# EAGLE design Displayduino_3_0 (EAGLE 4.16)
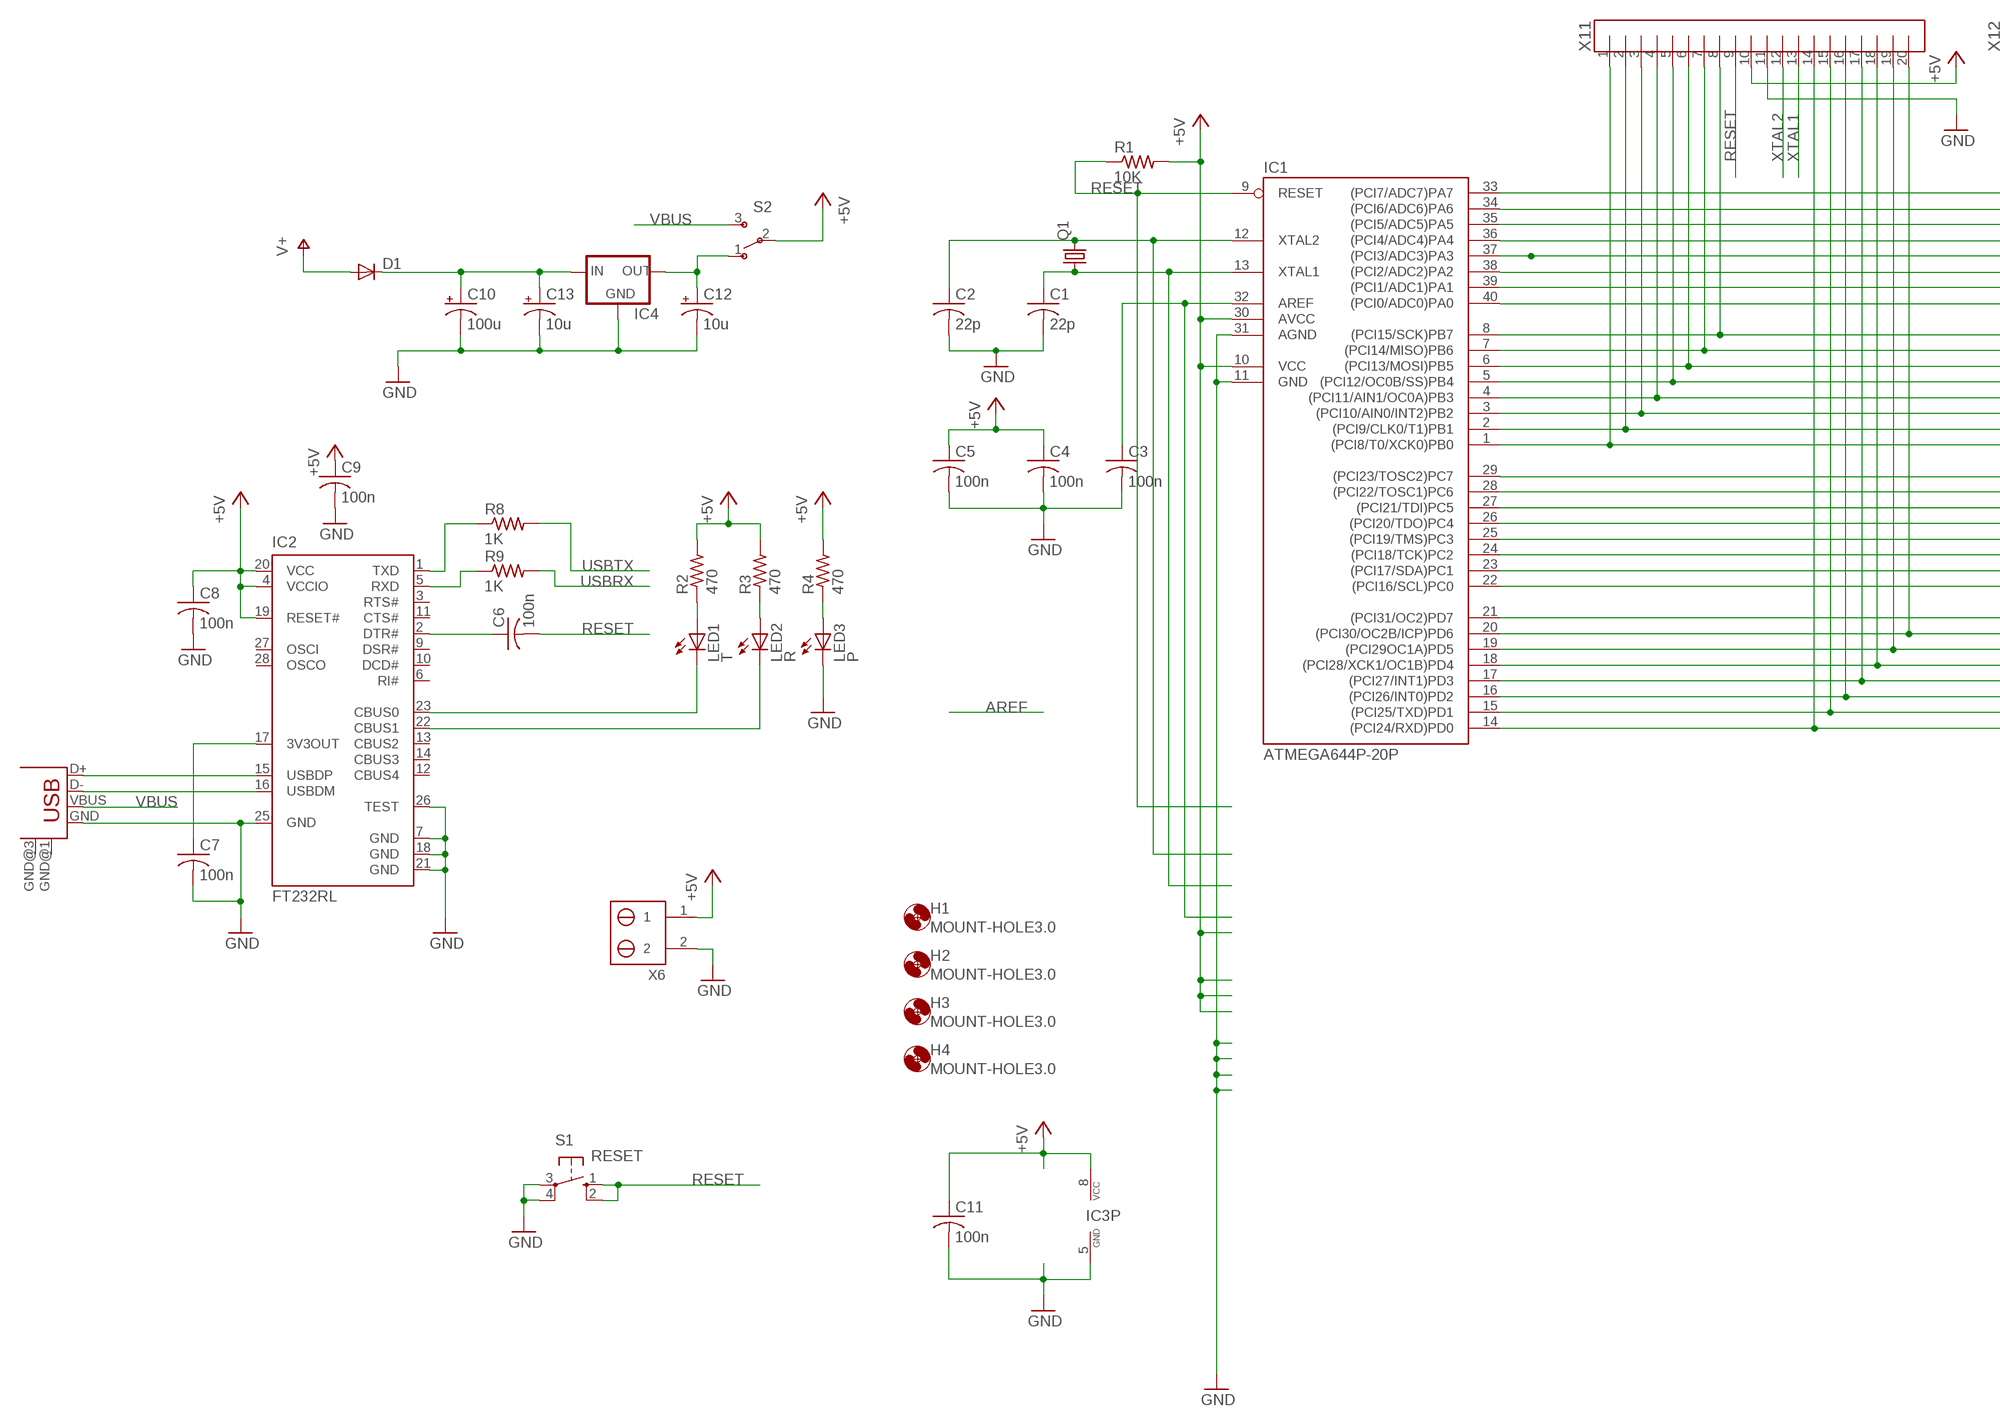
[diagram p0: schematic, sheet 1, part 1 of 2]
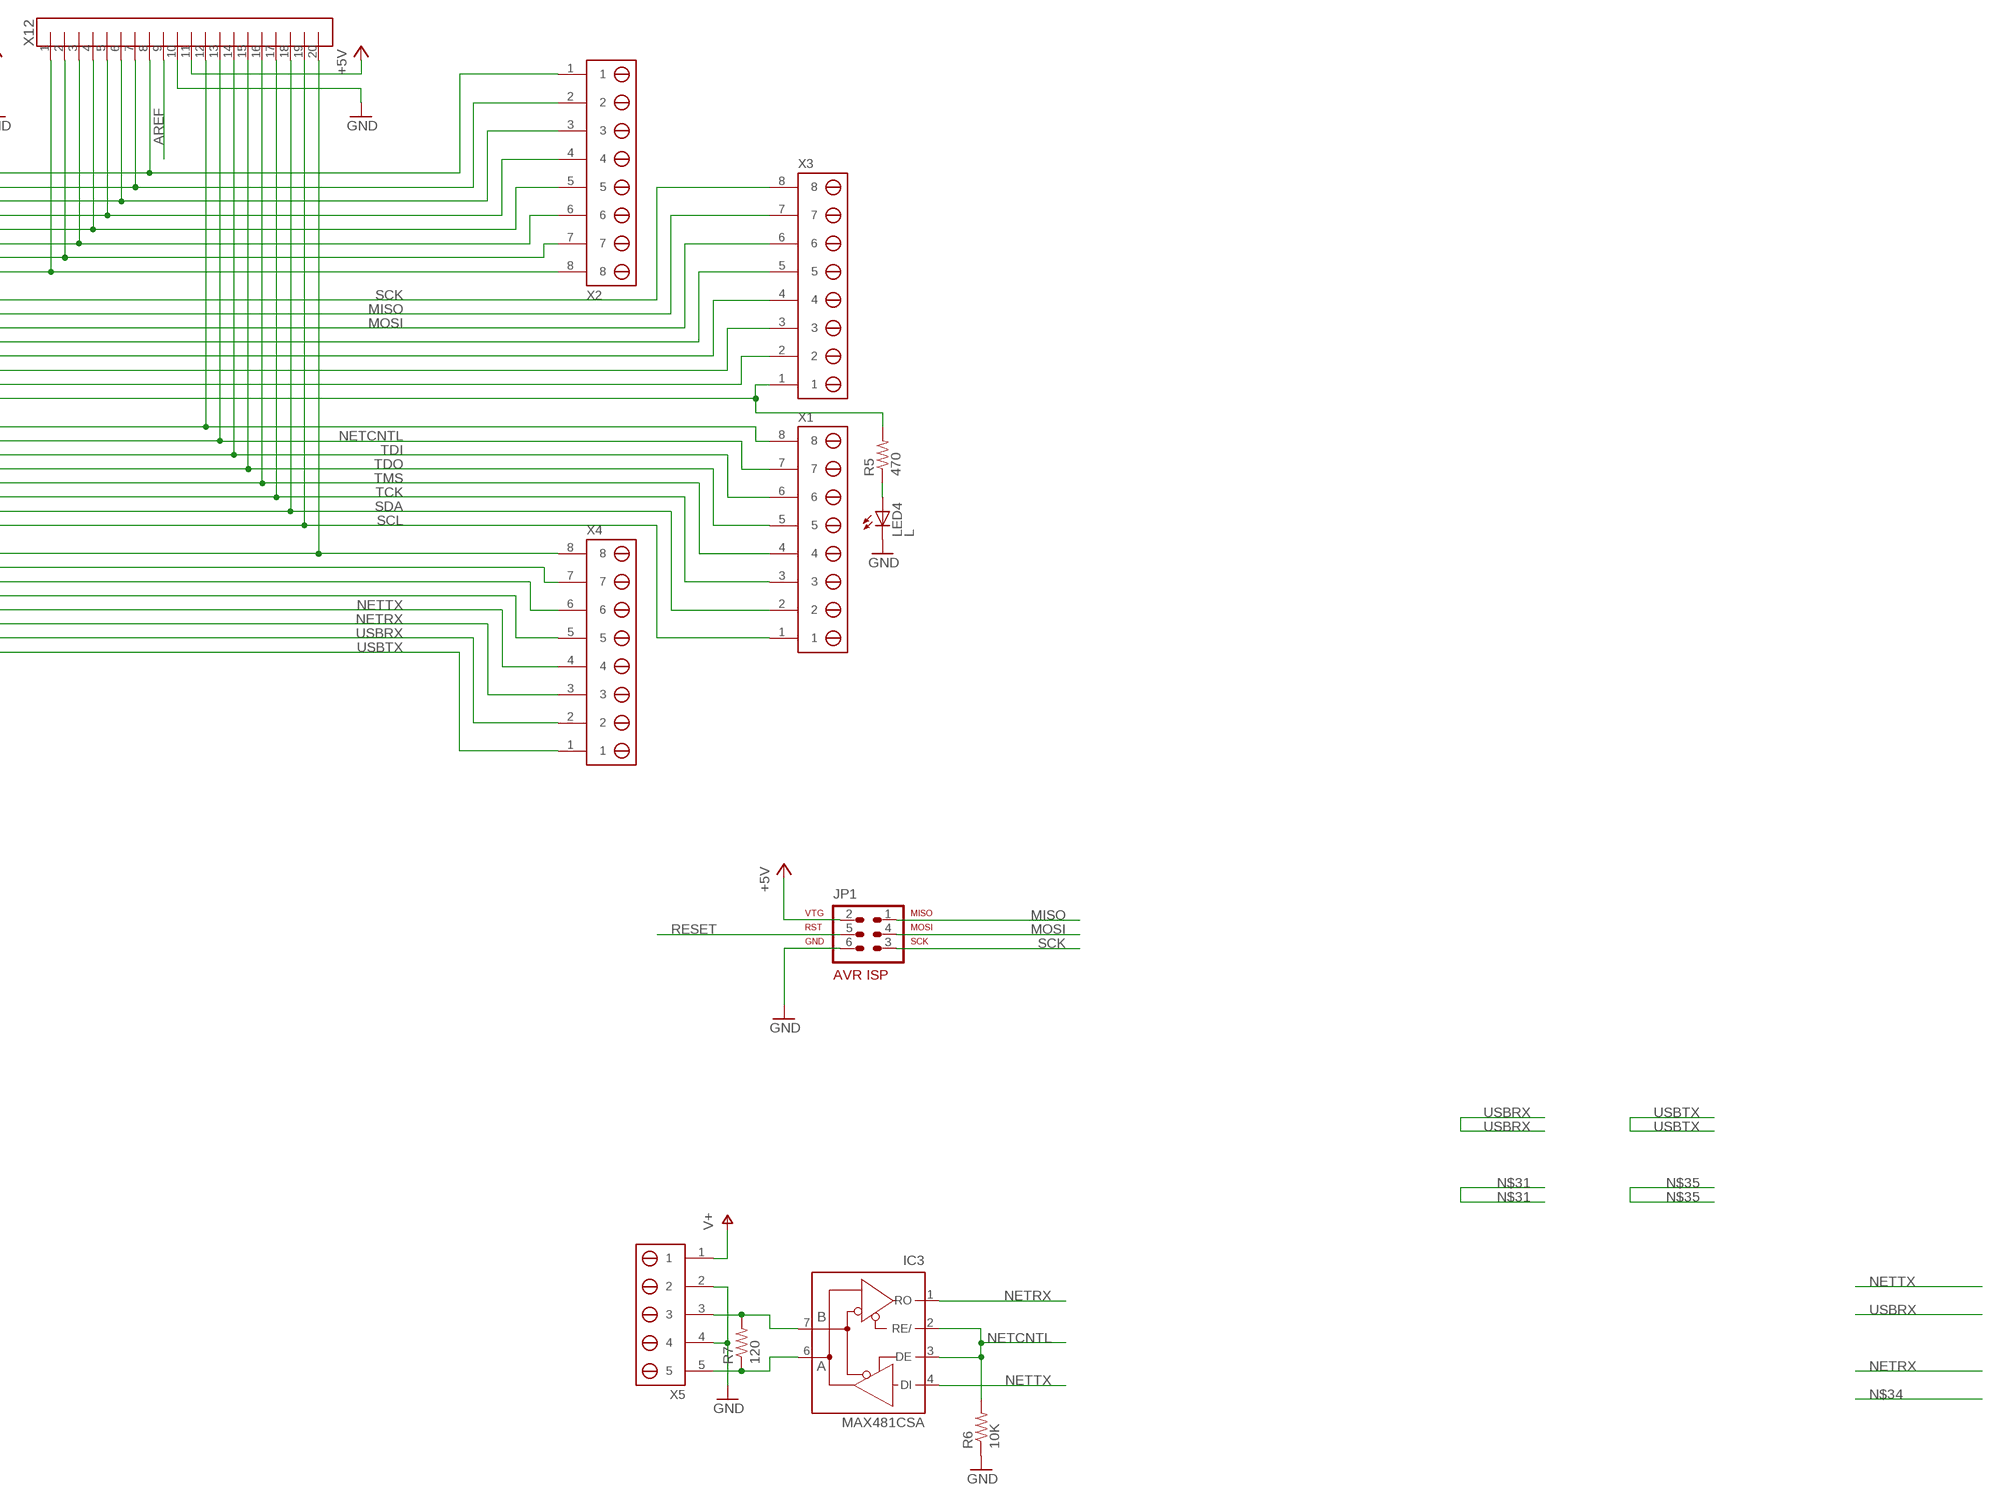
[diagram p1: schematic, sheet 1, part 2 of 2]

## Parts
C1  22p  C-USC0603  [C0603]
C2  22p  C-USC0603  [C0603]
C3  100n  C-USC0603  [C0603]
C4  100n  C-USC0603  [C0603]
C5  100n  C-USC0603  [C0603]
C6  100n  C-USC0603  [C0603]
C7  100n  C-USC0603  [C0603]
C8  100n  C-USC0603  [C0603]
C9  100n  C-USC0603  [C0603]
C10  100u  CPOL-USD  [PANASONIC_D]
C11  100n  C-USC0603  [C0603]
C12  10u  CPOL-USB  [PANASONIC_B]
C13  10u  CPOL-USB  [PANASONIC_B]
D1  DIODESMA  [SMA-DIODE]
H1  MOUNT-HOLE3.0  [3,0]
H2  MOUNT-HOLE3.0  [3,0]
H3  MOUNT-HOLE3.0  [3,0]
H4  MOUNT-HOLE3.0  [3,0]
IC1  ATMEGA644P-20P  ATMEGA644-20P  [DIL40]
IC2  FT232RL  [SSOP28]
IC3  MAX481CSA  [SO08]
IC4  LM1117  [SOT223]
JP1  AVR-ISP-6  [AVR-ISP-6]
LED1  T  LEDCHIP-LED0603  [CHIP-LED0603]
LED2  R  LEDCHIP-LED0603  [CHIP-LED0603]
LED3  P  LEDCHIP-LED0603  [CHIP-LED0603]
LED4  L  LEDCHIP-LED0603  [CHIP-LED0603]
Q1  CRYSTALCTS406  [CTS406]
R1  10K  R-US_R0603  [R0603]
R2  470  R-US_R0603  [R0603]
R3  470  R-US_R0603  [R0603]
R4  470  R-US_R0603  [R0603]
R5  470  R-US_R0603  [R0603]
R6  10K  R-US_R0603  [R0603]
R7  120  R-US_R0603  [R0603]
R8  1K  R-US_R0603  [R0603]
R9  1K  R-US_R0603  [R0603]
S1  RESET  10-XXSMT  [B3FS]
S2  SWITCH-SPSTSMD  [AYZ0202]
X1  140-A-126-SMD/8  [SMT-SCREW-500-8]
X2  140-A-126-SMD/8  [SMT-SCREW-500-8]
X3  140-A-126-SMD/8  [SMT-SCREW-500-8]
X4  140-A-126-SMD/8  [SMT-SCREW-500-8]
X5  140-A-126-SMD/5  [SMT-SCREW-500-5]
X6  140-A-126-SMD/2  [SMT-SCREW-500-2]
X7  USB-MB-S  [USB-MB-S]
X11  M20-100MIL  [100MIL-20]
X12  M20-100MIL  [100MIL-20]

## Nets
+5V: C4.1 C5.1 C8.1 C9.1 C11.1 IC1.10(VCC) IC1.30(AVCC) IC2.4(VCCIO) IC2.19(RESET#) IC2.20(VCC) IC3.8(VCC) JP1.2 R1.2 R2.2 R3.2 R4.2 S2.2(P) X6.1 X11.10 X12.11
AREF: C3.1 IC1.32(AREF) X12.9
GND: C1.2 C2.2 C3.2 C4.2 C5.2 C7.2 C8.2 C9.2 C10.- C11.2 C12.- C13.- IC1.11(GND) IC1.31(AGND) IC2.7(GND) IC2.18(GND) IC2.21(GND) IC2.25(GND) IC2.26(TEST) IC3.5(GND) IC4.1(GND) JP1.6 LED3.C LED4.C R6.1 S1.3(P) S1.4(P1) X5.2 X5.4 X6.2 X7.GND X11.11 X12.10
MISO: IC1.7((PCI14/MISO)PB6) JP1.1 X3.7 X11.7
MOSI: IC1.6((PCI13/MOSI)PB5) JP1.4 X3.6 X11.6
N$1: IC1.20((PCI30/OC2B/ICP)PD6) X4.7 X11.20
N$2: IC1.19((PCI29OC1A)PD5) X4.6 X11.19
N$3: IC1.18((PCI28/XCK1/OC1B)PD4) X4.5 X11.18
N$4: IC2.15(USBDP) X7.D+
N$5: IC2.16(USBDM) X7.D-
N$6: LED1.A R2.1
N$7: C7.1 IC2.17(3V3OUT)
N$8: IC1.21((PCI31/OC2)PD7) X4.8 X12.20
N$9: LED2.A R3.1
N$10: IC2.5(RXD) R9.1
N$11: IC2.23(CBUS0) LED1.C
N$12: IC2.22(CBUS1) LED2.C
N$13: LED3.A R4.1
N$14: LED4.A R5.1
N$15: C12.+ IC4.2(OUT) S2.1(O)
N$16: IC1.33((PCI7/ADC7)PA7) X2.1 X12.8
N$17: IC1.34((PCI6/ADC6)PA6) X2.2 X12.7
N$18: IC1.35((PCI5/ADC5)PA5) X2.3 X12.6
N$19: IC1.36((PCI4/ADC4)PA4) X2.4 X12.5
N$20: IC1.37((PCI3/ADC3)PA3) X2.5 X12.4
N$21: IC1.38((PCI2/ADC2)PA2) X2.6 X12.3
N$22: IC1.39((PCI1/ADC1)PA1) X2.7 X12.2
N$23: IC1.40((PCI0/ADC0)PA0) X2.8 X12.1
N$24: IC1.1((PCI8/T0/XCK0)PB0) R5.2 X3.1 X11.1
N$25: IC1.2((PCI9/CLK0/T1)PB1) X3.2 X11.2
N$26: IC1.3((PCI10/AIN0/INT2)PB2) X3.3 X11.3
N$27: IC1.4((PCI11/AIN1/OC0A)PB3) X3.4 X11.4
N$28: IC1.5((PCI12/OC0B/SS)PB4) X3.5 X11.5
N$30: IC2.1(TXD) R8.1
N$32: IC1.29((PCI23/TOSC2)PC7) X1.8 X12.12
N$33: C6.1 IC2.2(DTR#)
N$104: C10.+ C13.+ D1.C IC4.3(IN)
NETCNTL: IC1.28((PCI22/TOSC1)PC6) IC3.2(RE/) IC3.3(DE) R6.2 X1.7 X12.13
NETRX: IC1.16((PCI26/INT0)PD2) IC3.1(RO) X4.3 X11.16
NETTX: IC1.17((PCI27/INT1)PD3) IC3.4(DI) X4.4 X11.17
RESET: C6.2 IC1.9(RESET) JP1.5 R1.1 S1.1(S) S1.2(S1) X11.9
RS485A: IC3.6(A) R7.1 X5.5
RS485B: IC3.7(B) R7.2 X5.3
SCK: IC1.8((PCI15/SCK)PB7) JP1.3 X3.8 X11.8
SCL: IC1.22((PCI16/SCL)PC0) X1.1 X12.19
SDA: IC1.23((PCI17/SDA)PC1) X1.2 X12.18
TCK: IC1.24((PCI18/TCK)PC2) X1.3 X12.17
TDI: IC1.27((PCI21/TDI)PC5) X1.6 X12.14
TDO: IC1.26((PCI20/TDO)PC4) X1.5 X12.15
TMS: IC1.25((PCI19/TMS)PC3) X1.4 X12.16
USBRX: IC1.15((PCI25/TXD)PD1) R9.2 X4.2 X11.15
USBTX: IC1.14((PCI24/RXD)PD0) R8.2 X4.1 X11.14
V+: D1.A X5.1
VBUS: S2.3(S) X7.VBUS
XTAL1: C1.1 IC1.13(XTAL1) Q1.1 X11.13
XTAL2: C2.1 IC1.12(XTAL2) Q1.3 X11.12
Unconnected: IC2.3(RTS#) IC2.6(RI#) IC2.9(DSR#) IC2.10(DCD#) IC2.11(CTS#) IC2.12(CBUS4) IC2.13(CBUS2) IC2.14(CBUS3) IC2.27(OSCI) IC2.28(OSCO) X7.GND@1(GND) X7.GND@3(GND)

## Library data of the parts
C1-C9 C11 = rcl:C-US: CAPACITOR, American symbol
C10 C12 C13 = rcl:CPOL-US: POLARIZED CAPACITOR, American symbol
D1 = sfe-sparkfun:DIODE: Diode These are standard reverse protection diodes and small signal diodes. SMA package can handle up to about 1A. SOD-323 can handle about 200mA. What the SOD-323 package when ordering, there are some mfgs out there that are 5-pin packages.
H1-H4 = holes:MOUNT-HOLE: MOUNTING HOLE with drill center marker
IC1 = avr:ATMEGA644*P: MICROCONTROLLER 64 kBytes FLASH 4 kBytes SRAM 2 kBytes EEPROM DUAL USART 8-channel 10 bit ADC
IC2 = ftdichip:FT232R: Source: http://www.ftdichip.com/Documents/DataSheets/DS_FT232R_v104.pdf
IC3 = maxim:MAX481CSA: RS485 TRANSEIVER
IC4 = v-reg-3:LM1117
JP1 = atmel-1:AVR-ISP-6: AVR ISP-6 Serial Programming Header
LED1-LED4 = led:LED: LED OSRAM: - CHIPLED LG R971, LG N971, LY N971, LG Q971, LY Q971, LO R971, LY R971 LH N974, LH R974 LS Q976, LO Q976, LY Q976 LO Q996 - Hyper CHIPLED LW Q18S LB Q993, LB Q99A, LB R99A - SideLED LS A670, LO A670, LY A670, LG A670, LP A670 LB A673, LV A673, LT A673, LW A673 LH A674 LY A675 LS A676, LA A676, LO A676, LY A676, LW A676 LS A679, LY A679, LG A679 - Hyper Micro SIDELED® LS Y876, LA Y876, LO Y876, LY Y876 LT Y87S - SmartLED LW L88C, LW L88S LB L89C, LB L89S, LG L890 LS L89K, LO L89K, LY L89K LS L896, LA L896, LO L896, LY L896 - TOPLED LS T670, LO T670, LY T670, LG T670, LP T670 LSG T670, LSP T670, LSY T670, LOP T670, LYG T670 LG T671, LOG T671, LSG T671 LB T673, LV T673, LT T673, LW T673 LH T674 LS T676, LA T676, LO T676, LY T676, LB T676, LH T676, LSB T676, LW T676 LB T67C, LV T67C, LT T67C, LS T67K, LO T67K, LY T67K, LW E67C LS E67B, LA E67B, LO E67B, LY E67B, LB E67C, LV E67C, LT E67C LW T67C LS T679, LY T679, LG T679 LS T770, LO T770, LY T770, LG T770, LP T770 LB T773, LV T773, LT T773, LW T773 LH T774 LS E675, LA E675, LY E675, LS T675 LS T776, LA T776, LO T776, LY T776, LB T776 LHGB T686 LT T68C, LB T68C - Hyper Mini TOPLED® LB M676 - Mini TOPLED Santana® LG M470 LS M47K, LO M47K, LY M47K Source: http://www.osram.convergy.de - LUMILED® LXK2-PW12-R00, LXK2-PW12-S00, LXK2-PW14-U00, LXK2-PW14-V00 LXK2-PM12-R00, LXK2-PM12-S00, LXK2-PM14-U00 LXK2-PE12-Q00, LXK2-PE12-R00, LXK2-PE12-S00, LXK2-PE14-T00, LXK2-PE14-U00 LXK2-PB12-K00, LXK2-PB12-L00, LXK2-PB12-M00, LXK2-PB14-N00, LXK2-PB14-P00, LXK2-PB14-Q00 LXK2-PR12-L00, LXK2-PR12-M00, LXK2-PR14-Q00, LXK2-PR14-R00 LXK2-PD12-Q00, LXK2-PD12-R00, LXK2-PD12-S00 LXK2-PH12-R00, LXK2-PH12-S00 LXK2-PL12-P00, LXK2-PL12-Q00, LXK2-PL12-R00 Source: www.luxeon.com
Q1 = crystal:CRYSTAL: CRYSTAL
R1-R9 = rcl:R-US_: RESISTOR, American symbol
S1 = rbg-generic-tact-switch:10-XX: OMRON SWITCH
S2 = sfe-sparkfun:SWITCH-SPST: SPST Switch Simple slide switch. Spark Fun Electronics SKU : COM-00102
X1-X4 = rbg-weco-smt-screwterm:140-A-126-SMD/8
X5 = rbg-weco-smt-screwterm:140-A-126-SMD/5
X6 = rbg-weco-smt-screwterm:140-A-126-SMD/2
X7 = con-usb-2:USB: USB Connectors
X11 X12 = rbg-generic-headers:M20-100MIL

## Board
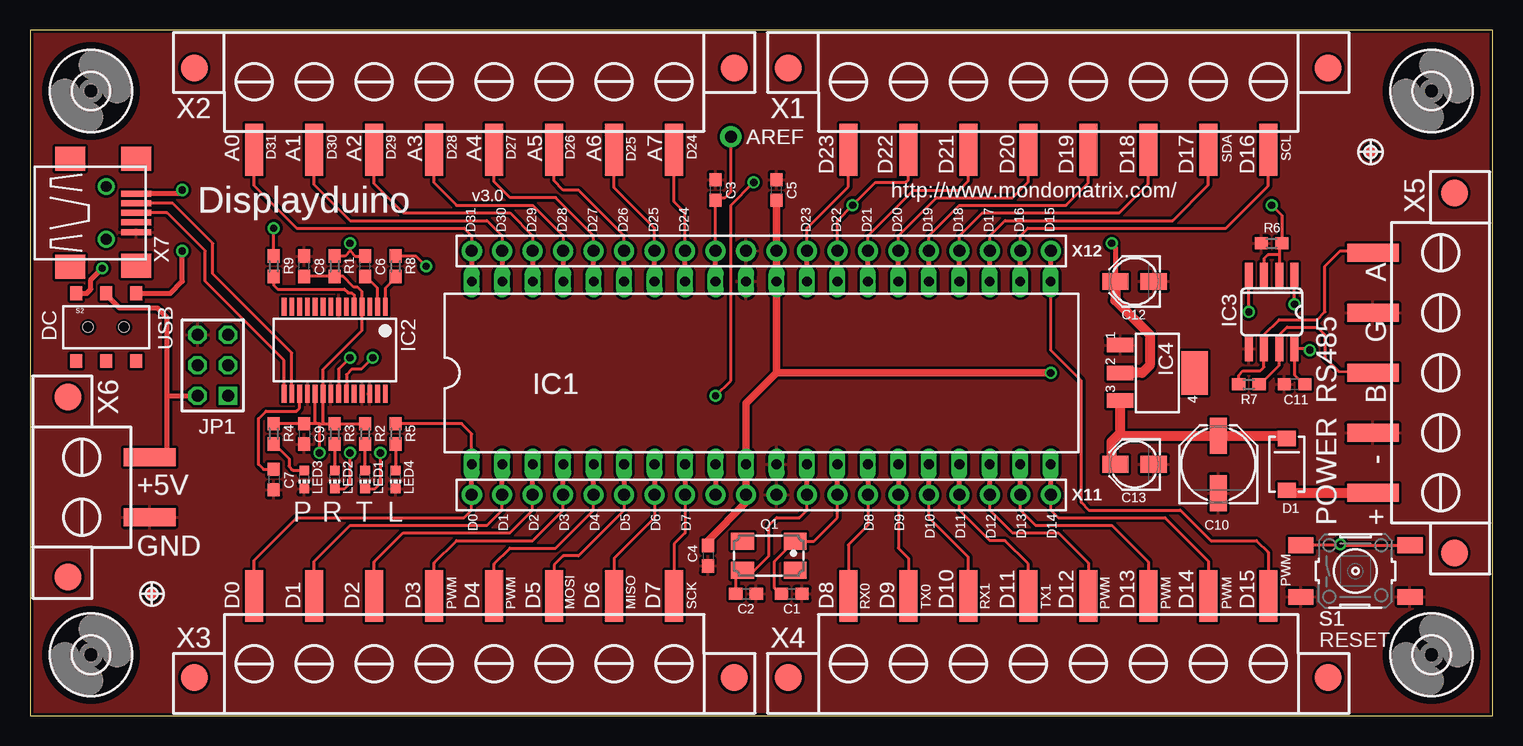
[diagram p2: board, top side]
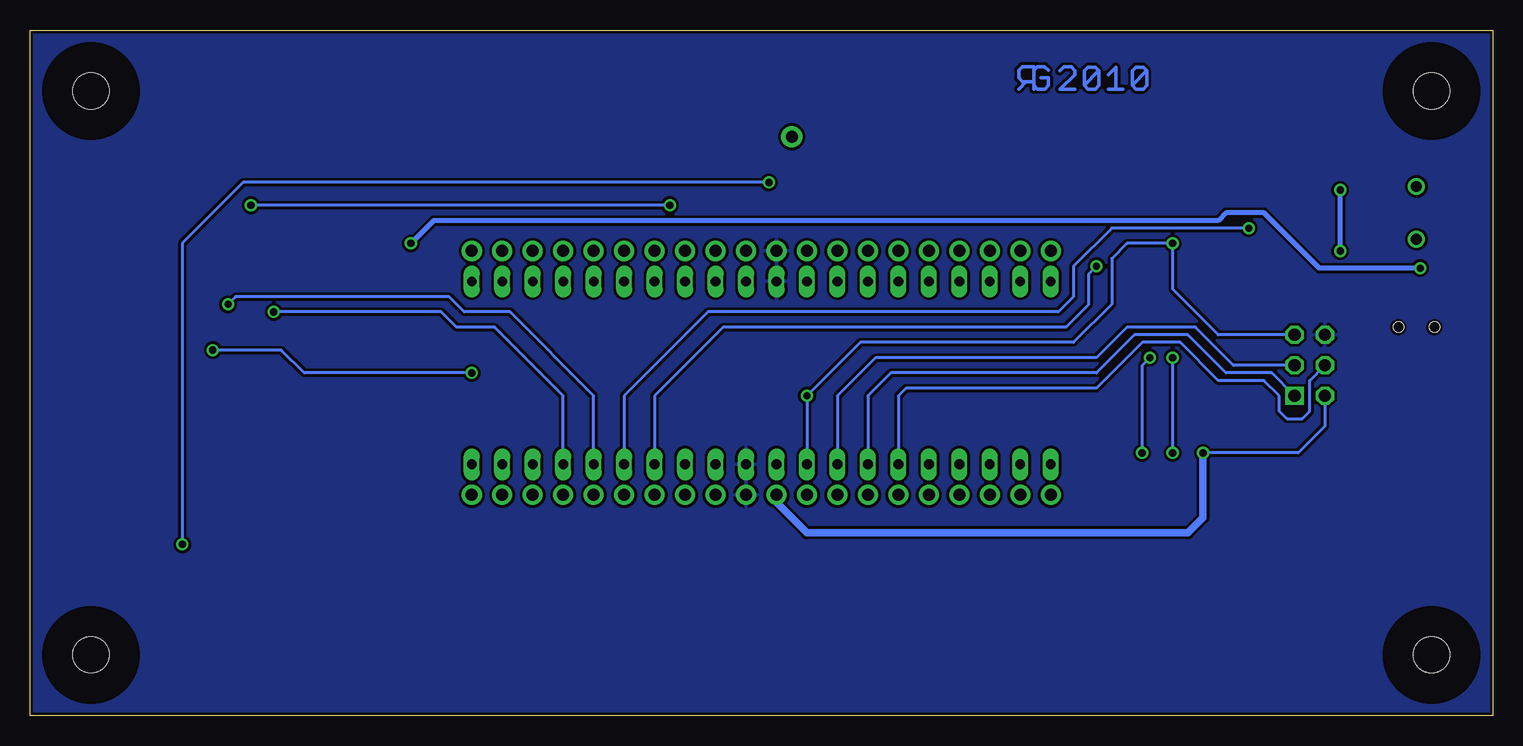
[diagram p3: board, bottom side, seen from below]

Size 121.92 x 57.15 mm. Coordinates in mm from the lower left corner, seen from the top.
Outline: 0,0 121.92,0 121.92,57.15 0,57.15 0,0
Copper layers (1*16): Top 0.035mm / dielectric 1.5mm / Bottom 0.035mm
Design rules "default": minimum track width 8mil, minimum drill 22mil, track to track 9mil, track to pad 9mil, pad to pad 9mil, via to via 9mil, smd to smd 9mil, copper to edge 10mil, drill to drill 8mil, minimum pad ring 10mil, minimum via ring 8mil, stop-mask expansion 4mil, vias tented up to drill 0mil, thermal gap 10mil
tRestrict: 1 lines

### Footprints (pad centres in the part's own frame; a part is rotated, then mirrored left to right if it is on the bottom)
C0603 = smd 1.1 x 1: 1 -0.85,0; 2 0.85,0
PANASONIC_D = smd 3 x 1.4: + 2.4,0; - -2.4,0
PANASONIC_B = smd 2.2 x 1.4: + 1.6,0; - -1.6,0
SMA-DIODE = smd 1.27 x 1.47: A -2.15,0; C 2.15,0
3,0 = hole 3: 0,0
DIL40 = drill 0.813 long: 1 -24.13,-7.62; 2 -21.59,-7.62; 3 -19.05,-7.62; 4 -16.51,-7.62; 5 -13.97,-7.62; 6 -11.43,-7.62; 7 -8.89,-7.62; 8 -6.35,-7.62; 9 -3.81,-7.62; 10 -1.27,-7.62; 11 1.27,-7.62; 12 3.81,-7.62; 13 6.35,-7.62; 14 8.89,-7.62; 15 11.43,-7.62; 16 13.97,-7.62; 17 16.51,-7.62; 18 19.05,-7.62; 19 21.59,-7.62; 20 24.13,-7.62; 21 24.13,7.62; 22 21.59,7.62; 23 19.05,7.62; 24 16.51,7.62; 25 13.97,7.62; 26 11.43,7.62; 27 8.89,7.62; 28 6.35,7.62; 29 3.81,7.62; 30 1.27,7.62; 31 -1.27,7.62; 32 -3.81,7.62; 33 -6.35,7.62; 34 -8.89,7.62; 35 -11.43,7.62; 36 -13.97,7.62; 37 -16.51,7.62; 38 -19.05,7.62; 39 -21.59,7.62; 40 -24.13,7.62
SSOP28 = smd 0.4 x 1.5: 1 -4.225,-3.625; 2 -3.575,-3.625; 3 -2.925,-3.625; 4 -2.275,-3.625; 5 -1.625,-3.625; 6 -0.975,-3.625; 7 -0.325,-3.625; 8 0.325,-3.625; 9 0.975,-3.625; 10 1.625,-3.625; 11 2.275,-3.625; 12 2.925,-3.625; 13 3.575,-3.625; 14 4.225,-3.625; 15 4.225,3.625; 16 3.575,3.625; 17 2.925,3.625; 18 2.275,3.625; 19 1.625,3.625; 20 0.975,3.625; 21 0.325,3.625; 22 -0.325,3.625; 23 -0.975,3.625; 24 -1.625,3.625; 25 -2.275,3.625; 26 -2.925,3.625; 27 -3.575,3.625; 28 -4.225,3.625
SO08 = smd 0.66 x 2.032: 1 -1.905,-3.073; 2 -0.635,-3.073; 3 0.635,-3.073; 4 1.905,-3.073; 5 1.905,3.073; 6 0.635,3.073; 7 -0.635,3.073; 8 -1.905,3.073
SOT223 = smd 1.219 x 2.235: 1 -2.311,-3.099; 2 0,-3.099; 3 2.311,-3.099 | smd 3.6 x 2.2: 4 0,3.099
AVR-ISP-6 = drill 1.016 square: 1 -2.54,-1.27 | drill 1.016 octagon: 2 -2.54,1.27; 3 0,-1.27; 4 0,1.27; 5 2.54,-1.27; 6 2.54,1.27
CHIP-LED0603 = smd 0.8 x 0.8: A 0,-0.75; C 0,0.75
CTS406 = smd 1.9 x 1.4: 1 -2.2,-1.2; 2 2.2,-1.2; 3 2.2,1.2; 4 -2.2,1.2
R0603 = smd 1.1 x 1: 1 -0.85,0; 2 0.85,0
B3FS = smd 2.1 x 1.3: 1 -4.55,2.15; 2 4.55,2.15; 3 -4.55,-2.15; 4 4.55,-2.15
AYZ0202 = smd 1 x 1.15: 1 -2.5,2.825; 2 0,2.825; 3 2.5,2.825; 4 -2.5,-2.825; 5 0,-2.825; 6 2.5,-2.825 | hole 0.85: 1.5,0; -1.5,0
SMT-SCREW-500-8 = smd 1.5 x 4.3: 1 -17.5,6.8; 2 -12.5,6.8; 3 -7.5,6.8; 4 -2.5,6.8; 5 2.5,6.8; 6 7.5,6.8; 7 12.5,6.8; 8 17.5,6.8 | smd 2.25 x 2.25: P$9 -22.5,0; P$10 22.5,0
SMT-SCREW-500-5 = smd 1.5 x 4.3: 1 -10,6.8; 2 -5,6.8; 3 0,6.8; 4 5,6.8; 5 10,6.8 | smd 2.25 x 2.25: P$9 -15,0; P$10 15,0
SMT-SCREW-500-2 = smd 1.5 x 4.3: 1 -2.5,6.8; 2 2.5,6.8 | smd 2.25 x 2.25: P$9 -7.5,0; P$10 7.5,0
USB-MB-S = smd 2.5 x 0.5: D+ 2.5,0; D- 2.5,0.8; GND 2.5,-1.6; ID 2.5,-0.8; VBUS 2.5,1.6 | smd 2.5 x 2: GND@1 -3,4.5; GND@2 2.5,4.5; GND@3 -3,-4.5; GND@4 2.5,-4.4 | drill 0.9 round: P$5 0,2.2; P$6 0,-2.2
100MIL-20 = drill 1 pad 1.676 round: 1 -24.13,0; 2 -21.59,0; 3 -19.05,0; 4 -16.51,0; 5 -13.97,0; 6 -11.43,0; 7 -8.89,0; 8 -6.35,0; 9 -3.81,0; 10 -1.27,0; 11 1.27,0; 12 3.81,0; 13 6.35,0; 14 8.89,0; 15 11.43,0; 16 13.97,0; 17 16.51,0; 18 19.05,0; 19 21.59,0; 20 24.13,0

### Placement (x,y rotation side)
C1  63.5,10.16 0 top
C2  59.69,10.16 0 top
C3  57.15,43.81 90 top
C4  56.52,13.34 270 top
C5  62.23,43.81 90 top
C6  27.94,37.47 90 top
C7  20.32,19.69 270 top
C8  22.86,37.47 90 top
C9  22.86,23.5 270 top
C10  99.06,20.95 90 top
C11  105.41,27.62 180 top
C12  92.08,36.2 180 top
C13  92.08,20.95 180 top
D1  104.77,20.95 90 top
H1  5.08,5.08 0 top
H2  116.84,5.08 0 top
H3  5.08,52.07 0 top
H4  116.84,52.07 0 top
IC1  60.96,28.57 0 top
IC2  25.4,30.48 180 top
IC3  103.5,33.66 180 top
IC4  93.98,28.57 270 top
JP1  15.24,29.21 90 top
LED1  27.94,19.69 180 top
LED2  25.4,19.69 180 top
LED3  22.86,19.69 180 top
LED4  30.48,19.69 180 top
Q1  61.59,13.34 180 top
R1  25.4,37.47 270 top
R2  27.94,23.5 90 top
R3  25.4,23.5 90 top
R4  20.32,23.5 90 top
R5  30.48,23.5 90 top
R6  103.5,39.37 0 top
R7  101.6,27.62 0 top
R8  30.48,37.47 90 top
R9  20.32,37.47 90 top
S1  110.49,12.06 0 top
S2  6.35,32.39 0 top
U$1  [RGLOGO_SMALL_2010]  38.1,52.07 0 bottom
U$2  [FIDUCIAL_G10]  111.76,46.99 0 top
U$4  [FIDUCIAL_G10]  10.16,10.16 0 top
X1  85.72,53.97 180 top
X2  36.2,53.97 180 top
X3  36.2,3.17 0 top
X4  85.72,3.17 0 top
X5  118.74,28.57 90 top
X6  3.17,19.05 270 top
X7  6.35,41.91 0 top
X11  60.96,18.41 0 top
X12  60.96,38.73 0 top

### Tracks (layer width: path | path; a pad name or v marks a point on that pad's centre or on a via)
+5V  (via drill 0.6)
  Top 0.254: C11.1 106.2,27.62 105.41,28.42 IC3.8 106.58,30.58 v106.68,30.48 | R4.2 22.8,24.34 22.86,24.29 C9.1 23.81,24.34 | 24.13,24.34 23.81,24.34 | 24.13,24.34 24.45,24.34 | 24.45,24.34 25.34,24.34 25.4,24.29 R3.2 27.88,24.34 27.94,24.29 R2.2 | 24.45,24.34 24.45,24.45 24.43,24.47 IC2.20 24.43,28.87 27.68,32.12 IC2.4 27.68,35.35 27.3,35.72 26.99,35.72 26.09,36.61 R1.2 25.4,36.67 25.34,36.61 C8.1 | 23.81,24.34 23.81,24.45 23.77,24.48 IC2.19 | v24.13,21.91 24.13,24.34
  Top 0.406: S2.2 6.35,35.08 7.46,33.97 10.64,33.97 11.43,33.18 11.43,26.67 | X6.1 9.97,21.56 10,21.59 11.43,21.59 11.43,26.67 | 11.43,26.67 JP1.2
  Top 0.61: X11.10 IC1.10 | X11.10 IC1.10 | C4.1 56.52,14.61 59.69,17.78 X11.10 | 62.23,43.18 C5.1 X12.11 IC1.30 62.23,28.57 | IC1.10 59.69,26.04 62.23,28.57 | 62.23,28.57 v85.09,28.57
  Bottom 0.254: v106.68,30.48 100.97,30.48 99.06,28.57 v85.09,28.57 | JP1.2 13.97,24.13 16.19,21.91 v24.13,21.91
  Bottom 0.61: X11.10 59.69,17.78 57.15,15.24 25.4,15.24 24.13,16.51 v24.13,21.91
AREF  (via drill 1 pad 1.78)
  Top 0.254: X12.9 C3.1 57.15,43.18 57.94,43.18 58.42,43.66 v58.42,48.26
  Top 0.406: IC1.32 X12.9
GND
  pour Top: -1.27,58.42 123.19,58.42 123.19,-1.27 -1.27,-1.27
  pour Bottom: -1.27,58.42 123.19,58.42 123.19,-1.27 -1.27,-1.27
MISO
  Top 0.254: X3.7 48.69,13.13 52.07,16.51 X11.7
  Top 0.406: IC1.7 X11.7
  Bottom 0.254: JP1.1 18.41,28.57 22.23,28.57 25.4,31.75 29.84,31.75 33.02,28.57 50.17,28.57 52.07,26.67 IC1.7
MOSI
  Top 0.254: X3.6 43.69,12.58 44.45,13.34 45.72,13.34 49.53,17.14 X11.6
  Top 0.406: IC1.6 X11.6
  Bottom 0.254: JP1.4 15.24,27.94 15.24,25.4 15.88,24.77 17.14,24.77 17.78,25.4 17.78,26.67 19.05,27.94 22.86,27.94 26.04,31.11 29.21,31.11 33.02,27.3 48.89,27.3 49.53,26.67 IC1.6
N$1
  Top 0.254: X11.20 85.09,17.14 85.72,16.51 94.61,16.51 98.22,12.9 X4.7
  Top 0.406: X11.20 IC1.20
N$2
  Top 0.254: X4.6 93.22,12.82 90.17,15.88 83.82,15.88 82.55,17.14 X11.19
  Top 0.406: X11.19 IC1.19
N$3
  Top 0.254: X4.5 88.22,12.74 85.72,15.24 81.91,15.24 80.01,17.14 X11.18
  Top 0.406: X11.18 IC1.18
N$4
  Top 0.254: X7.D+ 11.43,41.91 14.61,38.73 14.61,36.2 21.18,29.62 IC2.15
N$5
  Top 0.254: X7.D- 11.9,42.71 15.24,39.37 15.24,36.83 21.82,30.25 IC2.16
N$6
  Top 0.254: 27.94,20.32 LED1.A R2.1
N$7
  Top 0.254: IC2.17 22.48,25.65 22.23,25.4 19.69,25.4 19.05,24.77 19.05,20.95 19.47,20.54 C7.1
N$8
  Top 0.254: IC1.21 85.09,30.48 87.63,27.94 87.63,17.78 88.27,17.14 95.88,17.14 98.42,14.61 102.23,14.61 103.22,13.62 X4.8
  Top 0.406: IC1.21 X12.20
N$9
  Top 0.254: R3.1 LED2.A
N$10
  Top 0.254: IC2.5 27.02,35.05 26.83,35.24 26.51,35.24 26.19,35.56 20.64,35.56 20.32,35.88 R9.1
N$11  (via drill 0.6)
  Top 0.254: LED1.C 28.78,18.94 29.21,19.37 v29.21,21.91 | IC2.23 26.38,28.44 26.83,28.89 27.62,28.89 v28.57,29.84
  Bottom 0.254: v29.21,21.91 29.21,29.21 v28.57,29.84
N$12  (via drill 0.6)
  Top 0.254: IC2.22 25.73,28.9 v26.67,29.84 | LED2.C 26.24,18.94 26.67,19.37 v26.67,21.91
  Bottom 0.254: v26.67,21.91 v26.67,29.84
N$13
  Top 0.254: R4.1 20.38,22.64 21.59,21.43 21.59,20.8 21.91,20.48 22.86,20.48 LED3.A
N$14
  Top 0.254: 30.48,22.86 R5.1 LED4.A
N$15  (via drill 0.6)
  Top 0.406: S2.1 4.73,35.21 5.08,35.56 5.08,36.35 v6.03,37.31 | C12.+ 90.47,39.06 v90.17,39.37
  Top 0.813: IC4.2 92.71,28.57 93.34,29.21 93.34,31.75 90.47,34.62 C12.+
  Bottom 0.406: v6.03,37.31 14.45,37.31 19.05,41.91 22.23,41.91 22.86,41.27 88.27,41.27 v90.17,39.37
N$16
  Top 0.254: X2.1 53.69,42.83 54.61,41.91 X12.8
  Top 0.406: IC1.33 X12.8
N$17
  Top 0.254: X2.2 48.69,44.02 52.07,40.64 X12.7
  Top 0.406: IC1.34 X12.7
N$18
  Top 0.254: X2.3 43.69,44.57 44.45,43.81 45.72,43.81 49.53,40 X12.6
  Top 0.406: IC1.35 X12.6
N$19
  Top 0.254: X2.4 38.7,44.49 40,43.18 43.81,43.18 46.99,40 X12.5
  Top 0.406: IC1.36 X12.5
N$20
  Top 0.254: X2.5 33.7,44.41 35.56,42.55 41.91,42.55 44.45,40 X12.4
  Top 0.406: X12.4 IC1.37
N$21
  Top 0.254: X2.6 28.7,44.33 31.11,41.91 40,41.91 41.91,40 X12.3
  Top 0.406: X12.3 IC1.38
N$22
  Top 0.254: X2.7 23.7,44.25 26.67,41.27 38.1,41.27 39.37,40 X12.2
  Top 0.406: X12.2 IC1.39
N$23
  Top 0.254: X2.8 18.7,44.17 22.23,40.64 36.2,40.64 36.83,40 X12.1
  Top 0.406: X12.1 IC1.40
N$24
  Top 0.254: X3.1 18.7,12.98 22.23,16.51 36.2,16.51 36.83,17.14 X11.1 | R5.2 35.98,24.34 36.83,23.5 IC1.1
  Top 0.406: X11.1 IC1.1
N$25
  Top 0.254: X3.2 23.7,12.9 26.67,15.88 38.1,15.88 39.37,17.14 X11.2
  Top 0.406: X11.2 IC1.2
N$26
  Top 0.254: X3.3 28.7,12.82 31.11,15.24 40,15.24 41.91,17.14 X11.3
  Top 0.406: X11.3 IC1.3
N$27
  Top 0.254: X3.4 33.7,12.74 35.56,14.61 41.91,14.61 44.45,17.14 X11.4
  Top 0.406: X11.4 IC1.4
N$28
  Top 0.254: X3.5 38.7,12.66 40,13.97 43.81,13.97 46.99,17.14 X11.5
  Top 0.406: X11.5 IC1.5
N$30
  Top 0.254: R8.1 30.48,36.51 29.62,35.66 IC2.1
N$32
  Top 0.254: X1.8 68.22,44.09 64.77,40.64 X12.12
  Top 0.406: IC1.29 X12.12
N$33
  Top 0.254: 27.94,36.67 | 27.94,36.67 C6.1 | IC2.2 28.98,35.64 27.94,36.67
N$104
  Top 0.813: D1.C 104.77,23.18 104.6,23.36 C10.+ 90.8,23.36 | 90.33,21.27 90.65,20.95 C13.+ 90.17,20.95 90.17,22.86 90.66,23.36 90.8,23.36 | 90.8,23.36 90.8,23.5 90.88,23.57 IC4.3
NETCNTL  (via drill 0.6)
  Top 0.254: 104.14,38.42 IC3.2 | 104.14,38.42 104.14,39.05 104.46,39.37 R6.2 104.35,41.7 v103.5,42.55 | IC3.3 102.87,38.1 103.19,38.42 104.14,38.42 | X1.7 73.22,44.65 73.03,44.45 70.48,44.45 v68.58,42.55 67.31,41.27 X12.13
  Top 0.406: IC1.28 X12.13
  Bottom 0.254: v68.58,42.55 v103.5,42.55
NETRX  (via drill 0.6)
  Top 0.254: X4.3 78.22,13.21 74.93,16.51 X11.16 | 105.41,36.83 IC3.1 v105.41,34.29
  Top 0.406: X11.16 IC1.16
  Bottom 0.254: IC1.16 74.93,26.67 81.91,33.66 85.72,33.66 86.99,34.92 104.77,34.92 v105.41,34.29
NETTX  (via drill 0.6)
  Top 0.254: X4.4 83.22,12.66 81.28,14.61 80.01,14.61 77.47,17.14 X11.17 | 101.6,36.83 IC3.4 v101.6,33.66
  Top 0.406: X11.17 IC1.17
  Bottom 0.254: IC1.17 77.47,26.67 83.19,32.39 86.36,32.39 87.63,33.66 v101.6,33.66
RESET  (via drill 0.6)
  Top 0.254: v60.33,44.45 58.42,42.55 58.42,27.94 v57.15,26.67 | R1.1 26.25,38.31 26.67,38.73 | v26.67,39.37 26.67,38.73 | C6.2 27.09,38.31 26.67,38.73 | S1.1 109.15,14.21 v109.22,14.29 109.29,14.21 S1.2
  Top 0.406: IC1.9 X11.9
  Bottom 0.254: v60.33,44.45 104.14,44.45 109.22,39.37 v109.22,14.29 | IC1.9 v57.15,26.67 52.7,31.11 34.92,31.11 31.75,34.29 31.75,38.1 30.48,39.37 v26.67,39.37 26.67,35.56 22.86,31.75 JP1.5
RS485A
  Top 0.254: R7.1 100.75,28.36 101.12,28.73 102.55,28.73 102.87,29.05 IC3.6 102.87,31.75 104.14,33.02 107.31,33.02 107.95,33.66 107.95,37.47 109.22,38.73 111.76,38.73 111.8,38.7 X5.5
RS485B
  Top 0.254: 104.14,30.48 104.14,29.21 102.55,27.62 R7.2 | X5.3 109.1,28.7 107.95,29.84 107.95,31.75 107.31,32.39 104.77,32.39 104.14,31.75 104.14,30.48 | 104.14,30.48 IC3.7
SCK
  Top 0.254: X3.8 53.69,14.32 54.61,15.24 X11.8
  Top 0.406: IC1.8 X11.8
  Bottom 0.254: JP1.3 21.59,29.21 24.77,32.39 30.48,32.39 33.02,29.84 51.44,29.84 54.61,26.67 IC1.8
SCL
  Top 0.254: X1.1 103.22,44.17 99.69,40.64 83.19,40.64 82.55,40 X12.19
  Top 0.406: IC1.22 X12.19
SDA
  Top 0.254: X1.2 98.22,44.25 95.25,41.27 81.28,41.27 80.01,40 X12.18
  Top 0.406: IC1.23 X12.18
TCK
  Top 0.254: X1.3 93.22,44.33 90.8,41.91 79.38,41.91 77.47,40 X12.17
  Top 0.406: IC1.24 X12.17
TDI
  Top 0.254: X1.6 78.22,44.57 77.47,43.81 73.66,43.81 69.85,40 X12.14
  Top 0.406: IC1.27 X12.14
TDO
  Top 0.254: X1.5 83.22,44.49 81.91,43.18 75.56,43.18 72.39,40 X12.15
  Top 0.406: IC1.26 X12.15
TMS
  Top 0.254: X1.4 88.22,44.41 86.36,42.55 77.47,42.55 74.93,40 X12.16
  Top 0.406: IC1.25 X12.16
USBRX  (via drill 0.6)
  Top 0.254: X4.2 73.22,13.13 72.39,13.97 X11.15 | R9.2 v20.32,40.64
  Top 0.406: IC1.15 X11.15
  Bottom 0.254: IC1.15 72.39,26.67 65.41,33.66 36.2,33.66 34.92,34.92 34.92,37.47 31.75,40.64 v20.32,40.64
USBTX  (via drill 0.6)
  Top 0.254: X4.1 68.22,14.25 69.85,15.88 X11.14 | R8.2 32.17,38.31 v33.02,37.47
  Top 0.406: IC1.14 X11.14
  Bottom 0.254: IC1.14 69.85,26.67 64.14,32.39 35.56,32.39 33.66,34.29 33.66,36.83 v33.02,37.47
V+
  Top 0.813: D1.A 104.86,18.8 105.09,18.57 X5.1
VBUS  (via drill 0.6)
  Top 0.406: S2.3 11.71,35.21 12.7,36.2 v12.7,38.73 | X7.VBUS 12.39,43.51 v12.7,43.81
  Bottom 0.406: v12.7,38.73 v12.7,43.81
XTAL1
  Top 0.254: X11.13 67.31,16.51 65.33,14.54 Q1.1 63.75,14.54 62.07,12.86 62.07,10.64 62.55,10.16 C1.1
  Top 0.406: X11.13 IC1.13
XTAL2
  Top 0.254: X11.12 64.77,17.14 64.14,16.51 62.23,16.51 61.59,15.88 61.59,13.34 60.39,12.13 Q1.3 59.12,12.13 58.84,11.85 C2.1
  Top 0.406: X11.12 IC1.12

### Text on the board
tPlace: A0 | D31 | A1 | D30 | A2 | D29 | A3 | D28 | A4 | D27 | A5 | D26 | A6 | D25 | A7 | D24 | D23 | D22 | D21 | D20 | D19 | D18 | D17 | SDA | D16 | SCL | AREF | Displayduino | A | DC | USB | G | RS485 | B | - | +5V | POWER | + | GND | PWM | D0 | D1 | D2 | D3 | PWM | D4 | PWM | D5 | MOSI | D6 | MISO | D7 | SCK | D8 | RX0 | D9 | TX0 | D10 | RX1 | D11 | TX1 | D12 | PWM | D13 | PWM | D14 | PWM | D15
tNames: v3.0 | http://www.mondomatrix.com/ | D31 | D30 | D29 | D28 | D27 | D26 | D25 | D24 | D23 | D22 | D21 | D20 | D19 | D18 | D17 | D16 | D15 | D0 | D1 | D2 | D3 | D4 | D5 | D6 | D7 | D8 | D9 | D10 | D11 | D12 | D13 | D14
_tsilk: X2 | X1 | A0 | D31 | A1 | D30 | A2 | D29 | A3 | D28 | A4 | D27 | A5 | D26 | A6 | D25 | A7 | D24 | D23 | D22 | D21 | D20 | D19 | D18 | D17 | SDA | D16 | SCL | AREF | v3.0 | C3 | C5 | http://www.mondomatrix.com/ | Displayduino | X5 | D31 | D30 | D29 | D28 | D27 | D26 | D25 | D24 | D23 | D22 | D21 | D20 | D19 | D18 | D17 | D16 | D15 | R6 | X7 | X12 | R9 | C8 | R1 | C6 | R8 | A | DC | USB | S2 | IC2 | C12 | 1 | IC3 | IC4 | G | 2 | X6 | IC1 | 3 | 4 | R7 | C11 | RS485 | B | JP1 | R4 | C9 | R3 | R2 | R5 | LED3 | LED2 | LED1 | LED4 | - | C7 | +5V | P | R | T | L | X11 | C13 | D0 | D1 | D2 | D3 | D4 | D5 | D6 | D7 | D8 | D9 | D10 | D11 | D12 | D13 | D14 | D1 | Q1 | POWER | + | C10 | C4 | GND | PWM | D0 | D1 | D2 | D3 | PWM | D4 | PWM | D5 | MOSI | D6 | MISO | D7 | SCK | D8 | RX0 | D9 | TX0 | D10 | RX1 | D11 | TX1 | D12 | PWM | D13 | PWM | D14 | PWM | D15 | C2 | C1 | S1 | X3 | X4 | RESET